# EAGLE design A4982_R5 (EAGLE 5.11)
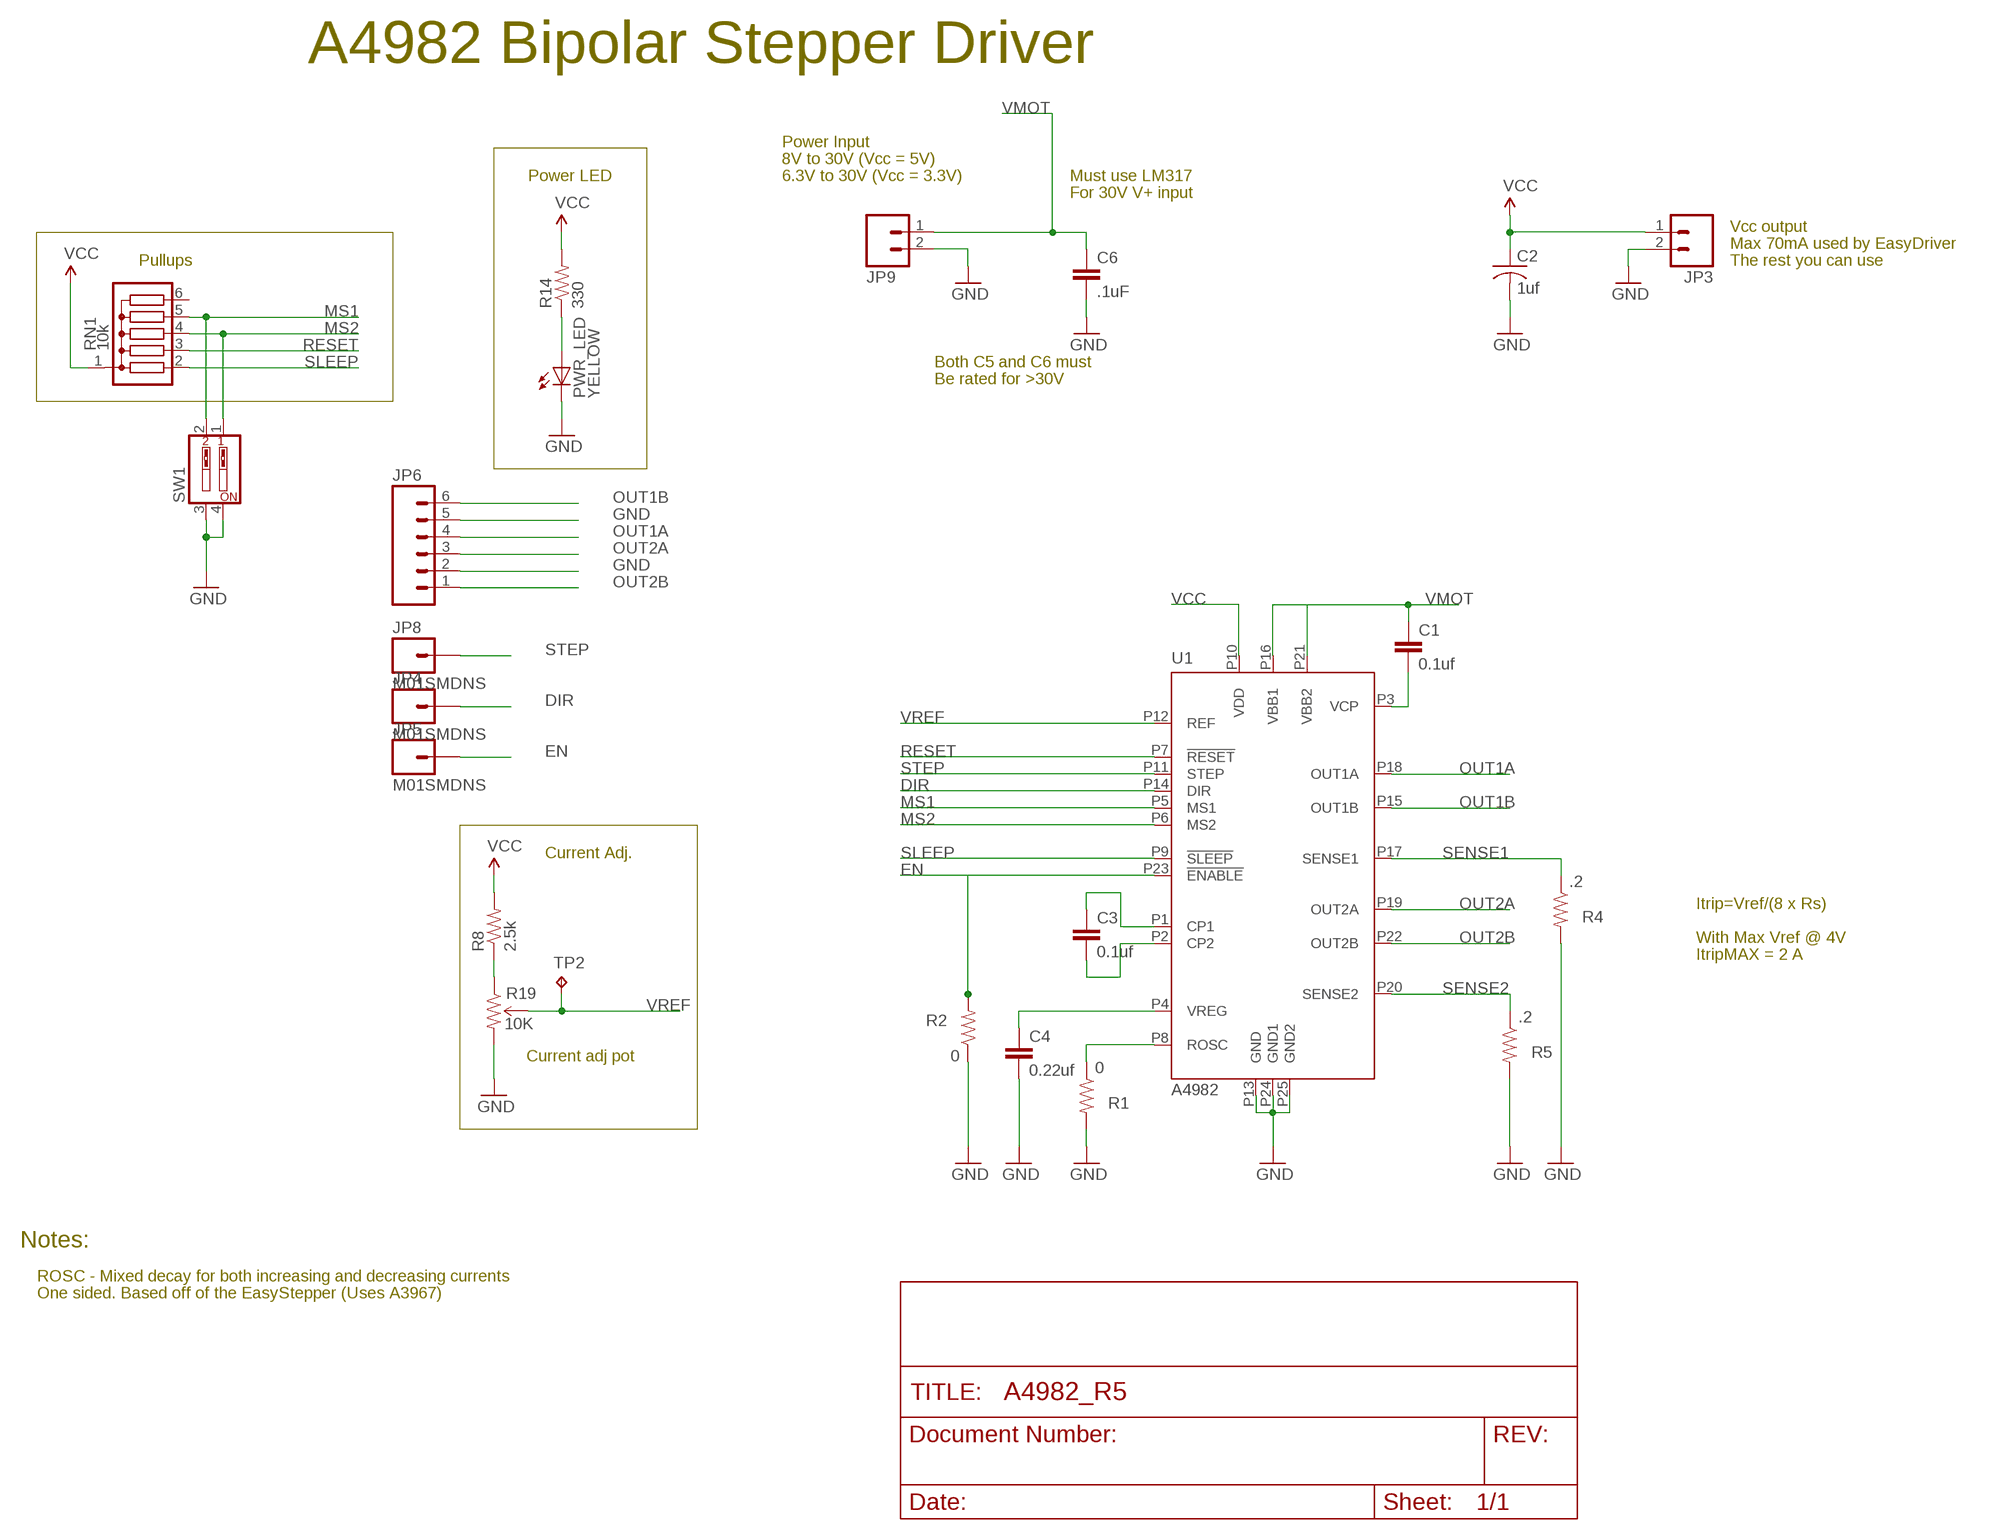
[diagram p0: schematic, sheet 1]

## Parts
C1  0.1uf  CAP0402-CAP  [0402-CAP]
C2  1uf  C-USC0603  [C0603]
C3  0.1uf  CAP0402-CAP  [0402-CAP]
C4  0.22uf  CAP0603-CAP  [0603-CAP]
C6  .1uF  CAP0805  [0805]
JP3  M021X02_NO_SILK  [1X02_NO_SILK]
JP4  M01SMDNS  [1X01NS]
JP5  M01SMDNS  [1X01NS]
JP6  M06SIP  [1X06]
JP8  M01SMDNS  [1X01NS]
JP9  M021X02_NO_SILK  [1X02_NO_SILK]
PWR_LED  YELLOW  LED5MM  [LED5MM]
R1  0  RESISTOR0402-RES  [0402-RES]
R2  0  RESISTOR0402-RES  [0402-RES]
R4  .2  RESISTOR2010  [R2010]
R5  .2  RESISTOR2010  [R2010]
R8  2.5k  RESISTOR0402-RES  [0402-RES]
R14  330  RESISTOR0402-RES  [0402-RES]
R19  10K  TRIMPOTSMD  [TRIMPOT-3MM]
RN1  10k  G05R  [SIL6]
SW1  SW_DIP-2  [DIPSWITCH-02]
TP2  TPPAD1-13  [P1-13]
U1  A4982  [TSSOP24]

## Nets
DIR: JP4.1 U1.P14(DIR)
EN: JP5.1 R2.2 U1.P23(!ENABLE)
GND: C2.2 C4.2 C6.2 JP3.2 JP6.2 JP6.5 JP9.2 PWR_LED.K(C) R1.2 R2.1 R4.2 R5.2 R19.3(CW) SW1.3 SW1.4 U1.P13(GND) U1.P24(GND1) U1.P25(GND2)
MS1: RN1.5 SW1.2 U1.P5(MS1)
MS2: RN1.4 SW1.1 U1.P6(MS2)
N$2: C3.1 U1.P1(CP1)
N$3: PWR_LED.A R14.1
N$4: C3.2 U1.P2(CP2)
N$6: C1.2 U1.P3(VCP)
N$8: R8.1 R19.1(CCW)
OUT1A: JP6.4 U1.P18(OUT1A)
OUT1B: JP6.6 U1.P15(OUT1B)
OUT2A: JP6.3 U1.P19(OUT2A)
OUT2B: JP6.1 U1.P22(OUT2B)
RESET: RN1.3 U1.P7(!RESET)
ROSC: R1.1 U1.P8(ROSC)
SENSE1: R4.1 U1.P17(SENSE1)
SENSE2: R5.1 U1.P20(SENSE2)
SLEEP: RN1.2 U1.P9(!SLEEP)
STEP: JP8.1 U1.P11(STEP)
VCC: C2.1 JP3.1 R8.2 R14.2 RN1.1 U1.P10(VDD)
VMOT: C1.1 C6.1 JP9.1 U1.P16(VBB1) U1.P21(VBB2)
VREF: R19.2(WIPER) TP2.TP U1.P12(REF)
VREG: C4.1 U1.P4(VREG)
Unconnected: RN1.6

## Notes on the sheet
- A4982 Bipolar Stepper Driver
- Power Input
- 8V to 30V (Vcc = 5V)
- Power LED | 6.3V to 30V (Vcc = 3.3V) | Must use LM317
- For 30V V+ input
- Vcc output
- Max 70mA used by EasyDriver
- Pullups | The rest you can use
- Both C5 and C6 must
- Be rated for >30V
- Current Adj.
- Itrip=Vref/(8 x Rs)
- With Max Vref @ 4V
- ItripMAX = 2 A
- Current adj pot
- Notes:
- ROSC - Mixed decay for both increasing and decreasing currents
- One sided. Based off of the EasyStepper (Uses A3967)

## Library data of the parts
C1 C3 C4 C6 = SparkFun:CAP: Capacitor Standard 0603 ceramic capacitor, and 0.1" leaded capacitor.
C2 = rcl:C-US: CAPACITOR, American symbol
JP3 JP9 = SparkFun:M02: Header 2 Standard 2-pin 0.1" header. Use with straight break away headers (SKU : PRT-00116), right angle break away headers (PRT-00553), swiss pins (PRT-00743), machine pins (PRT-00117), and female headers (PRT-00115). Molex polarized connector foot print use with SKU : PRT-08233 with associated crimp pins and housings.
JP4 JP5 JP8 = SparkFun:M01: Header 1 Standard 1-pin 0.1" header. Use with straight break away headers (SKU : PRT-00116), right angle break away headers (PRT-00553), swiss pins (PRT-00743), machine pins (PRT-00117), and female headers (PRT-00115).
JP6 = SparkFun:M06: Header 6 Standard 6-pin 0.1" header. Use with straight break away headers (SKU : PRT-00116), right angle break away headers (PRT-00553), swiss pins (PRT-00743), machine pins (PRT-00117), and female headers (PRT-00115). Molex polarized connector foot print use with SKU : PRT-08094 with associated crimp pins and housings. NOTES ON THE VARIANTS LOCK and LOCK_LONGPADS... This footprint was designed to help hold the alignment of a through-hole component (i.e. 6-pin header) while soldering it into place. You may notice that each hole has been shifted either up or down by 0.005 of an inch from it's more standard position (which is a perfectly straight line). This slight alteration caused the pins (the squares in the middle) to touch the edges of the holes. Because they are alternating, it causes a "brace" to hold the component in place. 0.005 has proven to be the perfect amount of "off-center" position when using our standard breakaway headers. Although looks a little odd when you look at the bare footprint, once you have a header in there, the alteration is very hard to notice. Also, if you push a header all the way into place, it is covered up entirely on the bottom side. This idea of altering the position of holes to aid alignment will be further integrated into the Sparkfun Library for other footprints. It can help hold any component with 3 or more connection pins.
PWR_LED = SparkFun:LED: LEDs Standard schematic elements and footprints for 5mm, 3mm, 1206, and 0603 sized LEDs. 5mm - Spark Fun Electronics SKU : COM-00529 (and others)
R1 R2 R4 R5 R8 R14 = SparkFun:RESISTOR: Resistor Basic schematic elements and footprints for 0603, 1206, and PTH resistors.
R19 = SparkFun:TRIMPOT
RN1 = resistor-sil:G05R: SIL RESISTOR; OC_FARNELL: unknown; OC_NEWARK: unknown
SW1 = SparkFun:SW_DIP-2: DIP SWITCH
TP2 = testpad:TP: Test pad
U1 = allegro:A4982: DMOS Stepper Motor Driver with Translator Source: http://www.allegromicro.com/en/Products/Part_Numbers/4982/4982.pdf

## Board
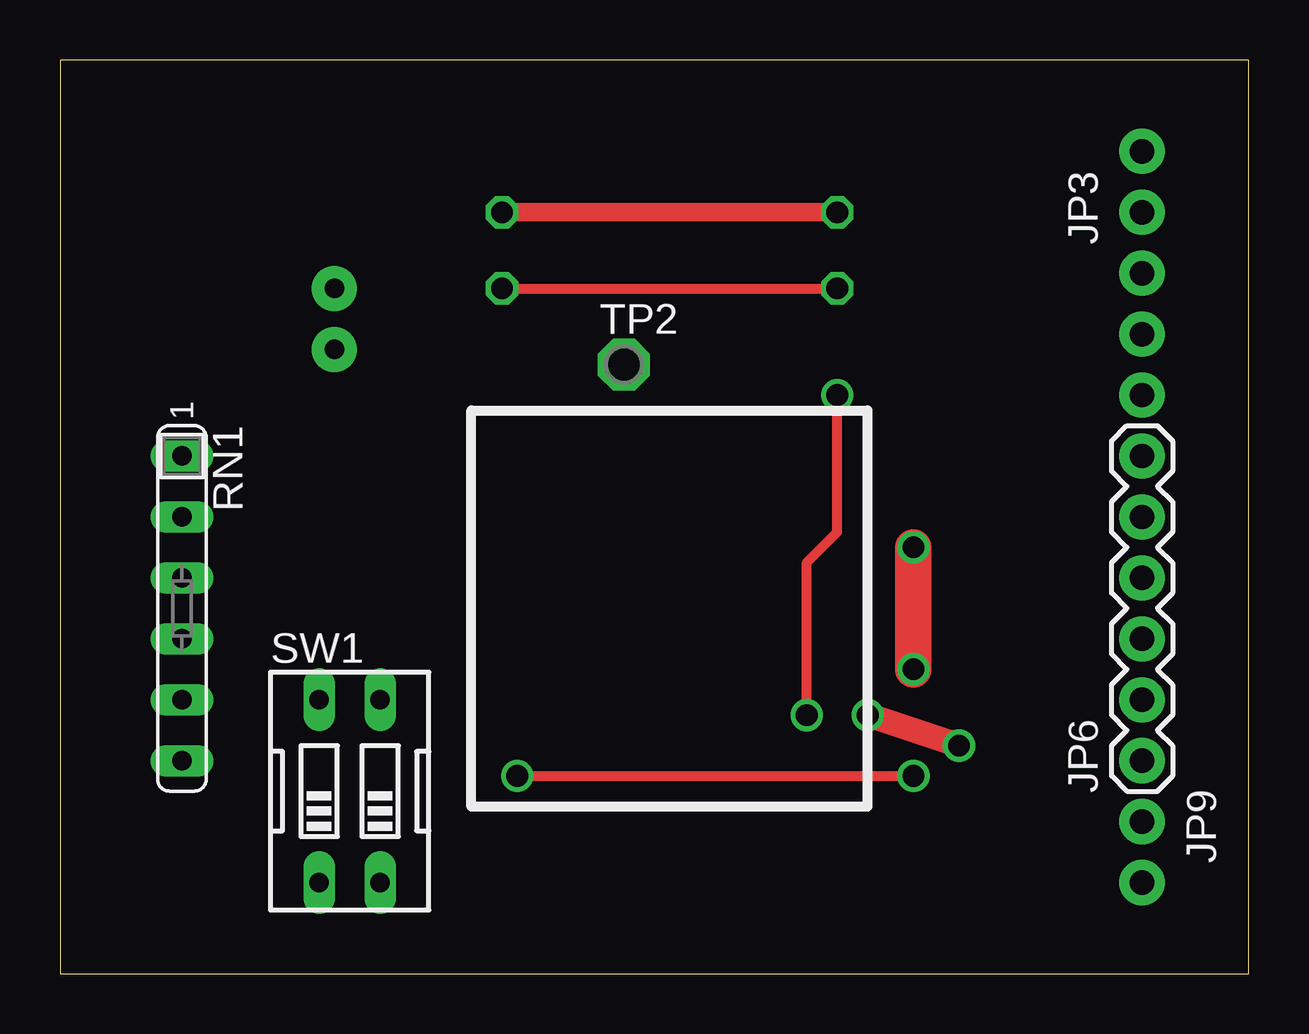
[diagram p1: board, top side]
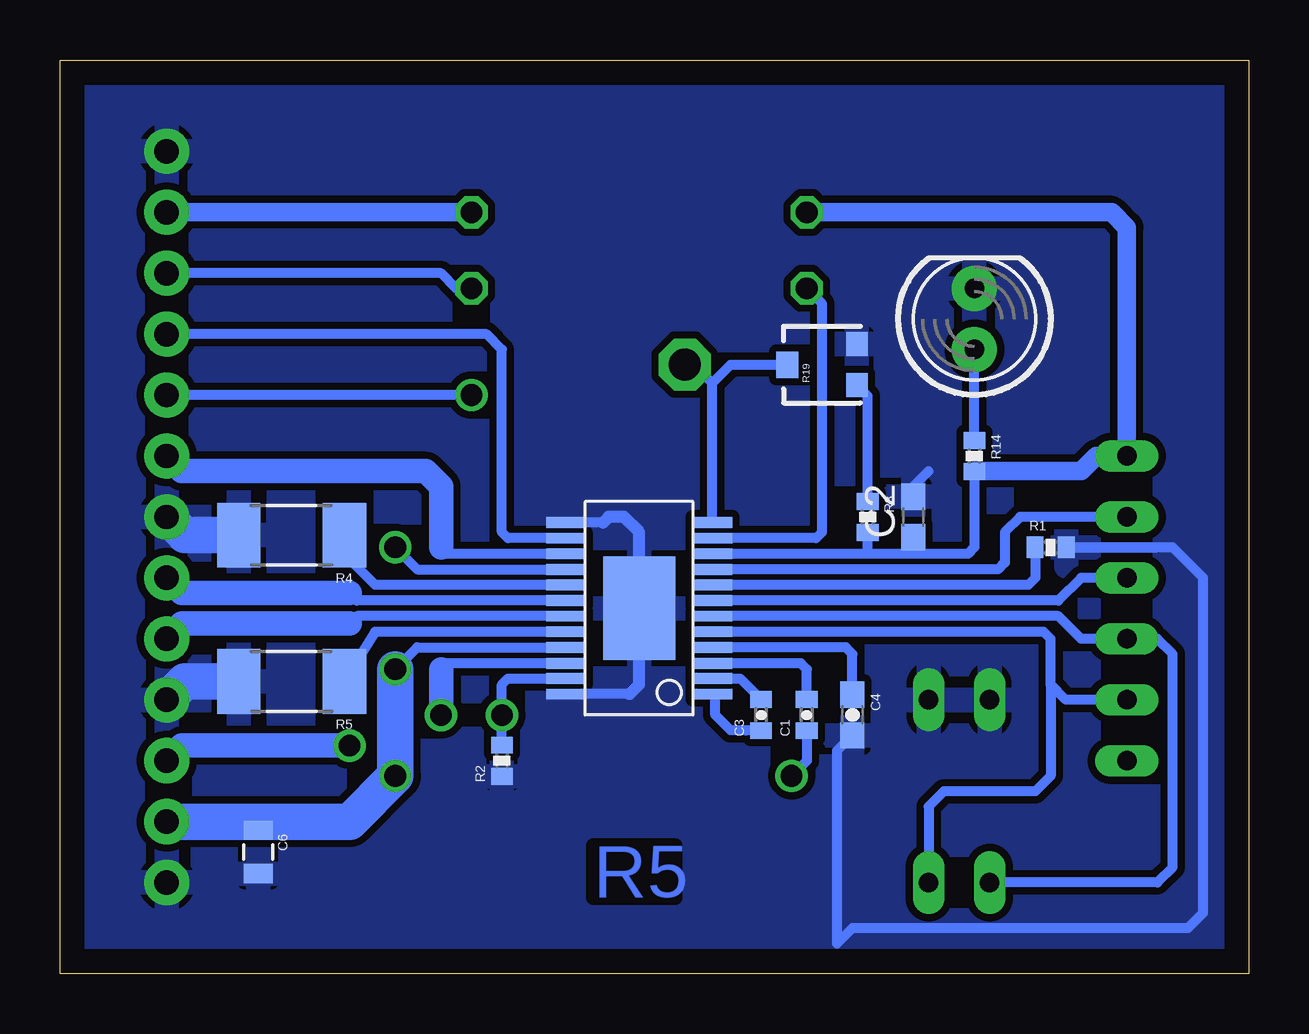
[diagram p2: board, bottom side, seen from below]

Size 49.53 x 38.1 mm. Coordinates in mm from the lower left corner, seen from the top.
Outline: 0,0 49.53,0 49.53,38.1 0,38.1 0,0
Copper layers (1*16): Top 0.035mm / dielectric 1.5mm / Bottom 0.035mm
Design rules "default *": minimum track width 8mil, minimum drill 24mil, track to track 7mil, track to pad 7mil, pad to pad 7mil, via to via 7mil, smd to smd 7mil, copper to edge 40mil, drill to drill 8mil, minimum pad ring 10mil, minimum via ring 8mil, stop-mask expansion 4mil, vias tented up to drill 0mil, thermal gap 10mil

### Footprints (pad centres in the part's own frame; a part is rotated, then mirrored left to right if it is on the bottom)
0402-CAP = smd 0.7 x 0.9: 1 -0.65,0; 2 0.65,0
C0603 = smd 1.1 x 1: 1 -0.85,0; 2 0.85,0
0603-CAP = smd 1.1 x 1: 1 -0.85,0; 2 0.85,0
0805 = smd 0.8 x 1.2: 1 -0.9,0; 2 0.9,0
1X02_NO_SILK = drill 1.016 pad 1.88 round: 1 0,0; 2 2.54,0
1X01NS = drill 1.016 pad 1.88 round: 1 0,0
1X06 = drill 1.016 pad 1.88 round: 1 0,0; 2 2.54,0; 3 5.08,0; 4 7.62,0; 5 10.16,0; 6 12.7,0
LED5MM = drill 0.813 pad 1.88 round: A -1.27,0; K 1.27,0
0402-RES = smd 0.7 x 0.9: 1 -0.65,0; 2 0.65,0
R2010 = smd 1.8 x 2.7: 1 -2.2,0; 2 2.2,0
TRIMPOT-3MM = smd 1 x 0.9: 1 -0.85,-1.45; 3 0.85,-1.45 | smd 1.1 x 0.9: 2 0,1.45
SIL6 = drill 0.813 long: 1 -6.35,0; 2 -3.81,0; 3 -1.27,0; 4 1.27,0; 5 3.81,0; 6 6.35,0
DIPSWITCH-02 = drill 0.813 long: 1 -1.27,-3.81; 2 1.27,-3.81; 3 1.27,3.81; 4 -1.27,3.81
P1-13 = drill 1.321 pad 2.159 octagon: TP 0,0
TSSOP24 = smd 0.45 x 1.65: P1 -3.575,-3.05; P2 -2.925,-3.05; P3 -2.295,-3.05; P4 -1.625,-3.05; P5 -0.975,-3.05; P6 -0.325,-3.05; P7 0.325,-3.05; P8 0.975,-3.05; P9 1.625,-3.05; P10 2.275,-3.05; P11 2.925,-3.05; P12 3.575,-3.05; P13 3.575,3.05; P14 2.925,3.05; P15 2.275,3.05; P16 1.625,3.05; P17 0.975,3.05; P18 0.325,3.05; P19 -0.325,3.05; P20 -0.975,3.05; P21 -1.625,3.05; P22 -2.295,3.05; P23 -2.925,3.05; P24 -3.575,3.05 | smd 4.32 x 3: P25 0,0

### Placement (x,y rotation side)
C1  18.41,10.79 90 bottom
C2  13.97,19.05 90 bottom
C3  20.32,10.79 90 bottom
C4  16.51,10.79 270 bottom
C6  41.27,5.08 270 bottom
JP3  45.09,31.75 90 top
JP4  45.09,26.67 0 top
JP5  45.09,24.13 0 top
JP6  45.09,8.89 90 top
JP8  45.09,29.21 0 top
JP9  45.09,6.35 270 top
PWR_LED  11.43,27.3 90 bottom
R1  8.26,17.78 0 bottom
R2  31.11,8.89 90 bottom
R4  39.88,18.29 180 bottom
R5  39.88,12.19 180 bottom
R8  15.88,19.05 270 bottom
R14  11.43,21.59 270 bottom
R19  17.78,25.4 90 bottom
RN1  5.08,15.24 270 top
SW1  12.06,7.62 0 top
TP2  23.5,25.4 0 top
U1  25.4,15.24 90 bottom

### Tracks (layer width: path | path; a pad name or v marks a point on that pad's centre or on a via)
DIR
  Bottom 0.406: U1.P14 30.86,18.16 31.11,18.41 31.11,26.04 31.75,26.67 JP4.1
EN  (via drill 0.9)
  Top 0.406: v31.11,10.79 31.11,17.14 32.38,18.41 v32.38,24.13
  Bottom 0.406: U1.P23 30.86,12.31 31.11,12.06 v31.11,10.79 R2.2 | v32.38,24.13 JP5.1
GND
  Bottom 0.406: 3.81,17.78 R1.2 3.17,17.78 1.91,16.51 1.91,2.54 2.54,1.91 16.51,1.91 17.14,1.27 17.14,9.31 C4.2 | C2.2 13.97,20.32 13.34,20.95 | 25.8,11.66 U1.P24 | 26.91,18.82 U1.P13
  Bottom 0.508: 26.91,18.82 26.67,19.05 26.04,19.05 25.4,18.41 U1.P25 25.4,12.06 25.8,11.66
  Bottom 1.524: R5.2 44.32,12.19 JP6.2 | R4.2 44.32,18.29 JP6.5
  pour Bottom (isolate 0.305): 0,38.1 0,0 49.53,0 49.53,38.1
MS1
  Bottom 0.406: U1.P5 8.55,14.27 8.26,13.97 8.26,12.06 | 8.26,12.06 7.62,11.43 RN1.5 | SW1.2 13.34,6.99 12.7,7.62 8.89,7.62 8.26,8.26 8.26,12.06
MS2
  Bottom 0.406: U1.P6 7.93,14.91 6.99,13.97 RN1.4 3.81,13.97 3.17,13.34 3.17,4.45 3.81,3.81 SW1.1
N$2
  Bottom 0.406: C3.1 20.94,10.14 20.95,10.16 21.59,10.16 22.23,10.79 22.23,11.54 U1.P1 21.82,11.66
N$3
  Bottom 0.406: R14.1 PWR_LED.A
N$4
  Bottom 0.406: C3.2 21.19,12.31 U1.P2
N$6
  Bottom 0.406: U1.P3 18.66,12.95 18.41,12.7 C1.2
N$8
  Bottom 0.406: R8.1 15.88,24.09 R19.1
OUT1A
  Bottom 0.406: U1.P18 37.16,15.56 37.47,15.88
  Bottom 1.016: 37.47,15.88 44.45,15.88 JP6.4
OUT1B
  Bottom 0.406: U1.P15 33.39,17.52 33.66,17.78
  Bottom 1.016: 33.66,17.78 33.66,20.32 34.29,20.95 44.45,20.95 JP6.6
OUT2A
  Bottom 0.406: U1.P19 37.16,14.91 37.47,14.61
  Bottom 1.016: 37.47,14.61 44.45,14.61 JP6.3
OUT2B  (via drill 0.9)
  Top 1.016: v33.66,10.79 v37.47,9.53
  Bottom 0.406: U1.P22 33.66,12.95 33.66,12.7
  Bottom 1.016: 33.66,12.7 v33.66,10.79 | v37.47,9.53 44.45,9.53 JP6.1
RESET
  Bottom 0.406: U1.P7 7.93,15.56 6.99,16.51 RN1.3
ROSC
  Bottom 0.406: U1.P8 9.19,16.21 8.89,16.51 8.89,17.77 R1.1
SENSE1
  Bottom 0.406: U1.P17 36.41,16.21 37.47,17.27 37.47,18.12 R4.1 37.55,18.41
SENSE2
  Bottom 0.406: U1.P20 36.41,14.27 R5.1
SLEEP
  Bottom 0.406: U1.P9 10.44,16.86 10.16,17.14 10.16,18.41 9.53,19.05 RN1.2
STEP  (via drill 0.9)
  Top 0.406: v18.41,28.57 v32.38,28.57
  Bottom 0.406: U1.P11 18.03,18.16 17.78,18.41 17.78,27.94 v18.41,28.57 | v32.38,28.57 33.02,28.57 33.66,29.21 JP8.1
VCC  (via drill 0.9)
  Top 0.762: v18.41,31.75 v32.38,31.75
  Bottom 0.406: 15.88,17.52 U1.P10 | 13.97,18.41 C2.1 13.97,17.52 | 15.88,17.52 R8.2 | 13.97,17.52 15.88,17.52 | 13.97,17.52 11.7,17.52 11.43,17.78 R14.2
  Bottom 0.762: v32.38,31.75 JP3.1 | v18.41,31.75 5.71,31.75 5.08,31.11 RN1.1 6.35,21.59 6.99,20.95 11.41,20.95 R14.2
VMOT  (via drill 0.9)
  Top 0.406: v19.05,8.26 v35.56,8.26
  Top 1.524: v35.56,12.7 v35.56,17.78
  Bottom 0.406: U1.P16 34.65,16.86 v35.56,17.78 | U1.P21 34.65,13.62 v35.56,12.7 | C1.1 18.41,8.89 v19.05,8.26 | JP9.1 42.91,6.35
  Bottom 0.508: 41.27,6.35 C6.1
  Bottom 1.524: JP9.1 41.27,6.35 37.47,6.35 v35.56,8.26 v35.56,12.7
VREF
  Bottom 0.406: U1.P12 22.35,24.64 | 22.35,24.64 21.59,25.4 R19.2 | TP2.TP 23.11,25.4 22.35,24.64
VREG
  Bottom 0.406: U1.P4 16.79,13.62 16.51,13.34 C4.1

### Text on the board
Bottom: R5